# Altium schematic sheet Throttle ADC.SchDoc
size A4; Organization: TESLA Motors, INC; Address1: 3500 Deer Creek Road; Address2: Palo Alto, CA; Address4: U.S.A.; SheetNumber: 10; SheetTotal: 17
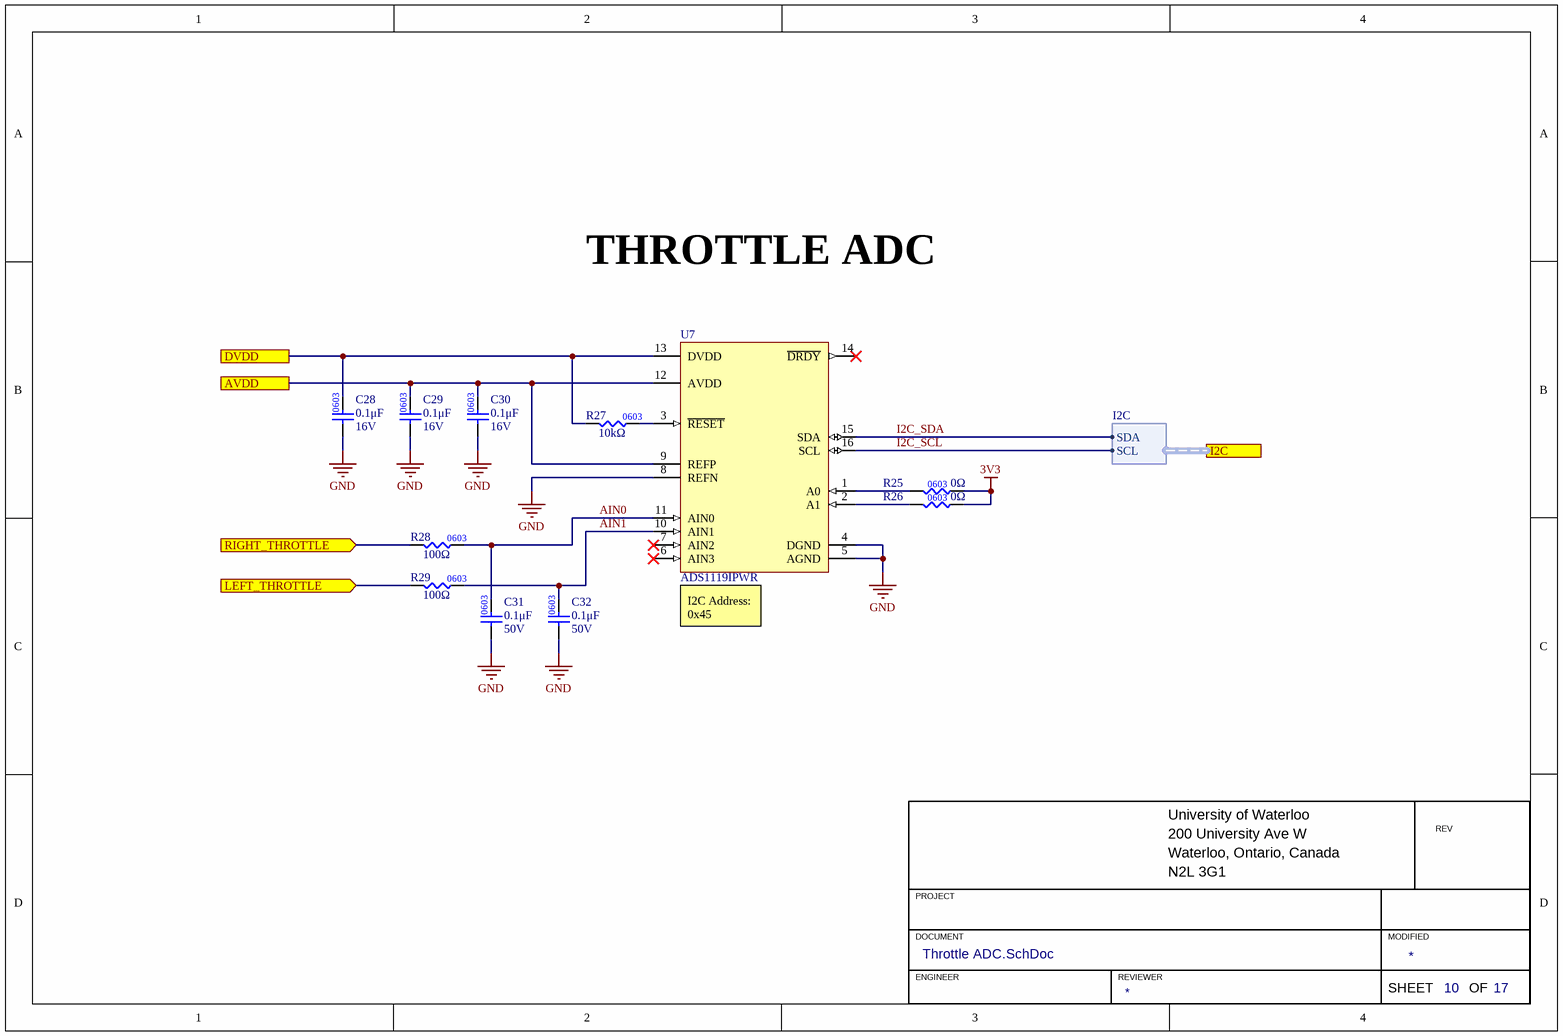
[diagram p0: Throttle ADC.SchDoc]

## Parts
C28  value 0.1μF  Voltage Rating: 16V  [CAP0603]  (hidden comment: CAP_0.1uF_16V_0603)
C29  value 0.1μF  Voltage Rating: 16V  [CAP0603]  (hidden comment: CAP_0.1uF_16V_0603)
C30  value 0.1μF  Voltage Rating: 16V  [CAP0603]  (hidden comment: CAP_0.1uF_16V_0603)
C31  value 0.1μF  Voltage Rating: 50V  [CAP0603]  (hidden comment: CAP_0.1uF_50V_0603)
C32  value 0.1μF  Voltage Rating: 50V  [CAP0603]  (hidden comment: CAP_0.1uF_50V_0603)
R25  value 0Ω  [RES0603]  (hidden comment: RES_0Ω_0603)
R26  value 0Ω  [RES0603]  (hidden comment: RES_0Ω_0603)
R27  value 10kΩ  [RES0603]  (hidden comment: RES_10kΩ_0603_1%)
R28  value 100Ω  [RES0603]  (hidden comment: RES_100Ω_0603_1%)
R29  value 100Ω  [RES0603]  (hidden comment: RES_100Ω_0603_1%)
U7  ADS1119IPWR  [TI_16-TSSOP]

## Ports
AVDD (see Top[3A]), DVDD (see Top[3A]), I2C (harness I2C, see Top[3A], Real Time Clock[4B], STM32 MCU[1A]), LEFT_THROTTLE (in, see Top[4A], Throttle Interfaces[2C]), RIGHT_THROTTLE (in, see Top[4A], Throttle Interfaces[2B])

## Harnesses
I2C: SDA, SCL

## Nets
3V3: R25.1 R26.1
GND: C28.1 C29.1 C30.1 C31.1 C32.1 U7.4(DGND) U7.5(AGND) U7.8(REFN)
AIN0: C31.2 R28.2 U7.11(AIN0)
AIN1: C32.2 R29.2 U7.10(AIN1)
AVDD: C29.2 C30.2 U7.9(REFP) U7.12(AVDD) ; port AVDD
DVDD: C28.2 R27.1 U7.13(DVDD) ; port DVDD
I2C_SCL: U7.16(SCL) ; port I2C.SCL
I2C_SDA: U7.15(SDA) ; port I2C.SDA
LEFT_THROTTLE: R29.1 ; port LEFT_THROTTLE
RIGHT_THROTTLE: R28.1 ; port RIGHT_THROTTLE
NetR25_2: R25.2 U7.1(A0)
NetR26_2: R26.2 U7.2(A1)
NetR27_2: R27.2 U7.3(~{RESET})

Not connected (* = marked no-connect by the designer): U7 6(AIN3)* 7(AIN2)* 14(~{DRDY})*

## Notes on the sheet
- THROTTLE ADC
- (near U7) I2C Address:
  0x45
- University of Waterloo
- 200 University Ave W
- REV
- PROJECT
- Waterloo, Ontario, Canada
- N2L 3G1
- DOCUMENT
- ENGINEER
- REVIEWER
- MODIFIED
- SHEET
- OF
- (in symbol RES_100Ω_0603_1%) 0603

## Library data of the parts
C28-C30 = CAP_0.1uF_16V_0603: CAP CER 0.1UF 16V X7R 0603; Manufacturer Part Number 1: CC0603KRX7R7BB104; Manufacturer 1: Yageo; Package: 0603; Supplier Part Number 1: 311-1088-1-ND; Supplier 1: Digi-Key; Dielectric: X7R
C31 C32 = CAP_0.1uF_50V_0603: CAP CER 0.1UF 50V X7R 0603; Manufacturer Part Number 1: CC0603KRX7R9BB104; Manufacturer 1: Yageo; Package/Footprint: 0603; Supplier Part Number 1: 311-1344-1-ND; Supplier 1: Digi-Key; Mounting Type: SMD; Dielectric: X7R
R25 R26 = RES_0Ω_0603: RES 0 OHM JUMPER 1/10W 0603; Manufacturer 1: Yageo; Manufacturer Part Number 1: RC0603JR-070RL; Supplier Part Number 1: 311-0.0GRCT-ND; Supplier 1: Digi-Key; Mounting Type: SMD; Package: 0603
R27 = RES_10kΩ_0603_1%: RES 10K OHM 1% 1/8W 0603; Manufacturer 1: Stackpole Electronics Inc; Manufacturer Part Number 1: RNCP0603FTD10K0; Supplier Part Number 1: RNCP0603FTD10K0CT-ND; Supplier 1: Digi-Key; Mounting Type: SMD; Package: 0603
R28 R29 = RES_100Ω_0603_1%: RES 100 OHM 1% 1/10W 0603; Manufacturer 1: Yageo; Manufacturer Part Number 1: RC0603FR-07100RL; Supplier Part Number 1: 311-100HRCT-ND; Supplier 1: Digi-Key
U7 = ADS1119IPWR: IC ADC 16BIT SIGMA-DELTA 16TSSOP; Manufacturer 1: Texas Instruments; Manufacturer Part Number 1: ADS1119IPWR; Footprint: 16-TSSOP; Supplier 1: Digikey; Supplier Part Number 1: 296-50874-1-ND